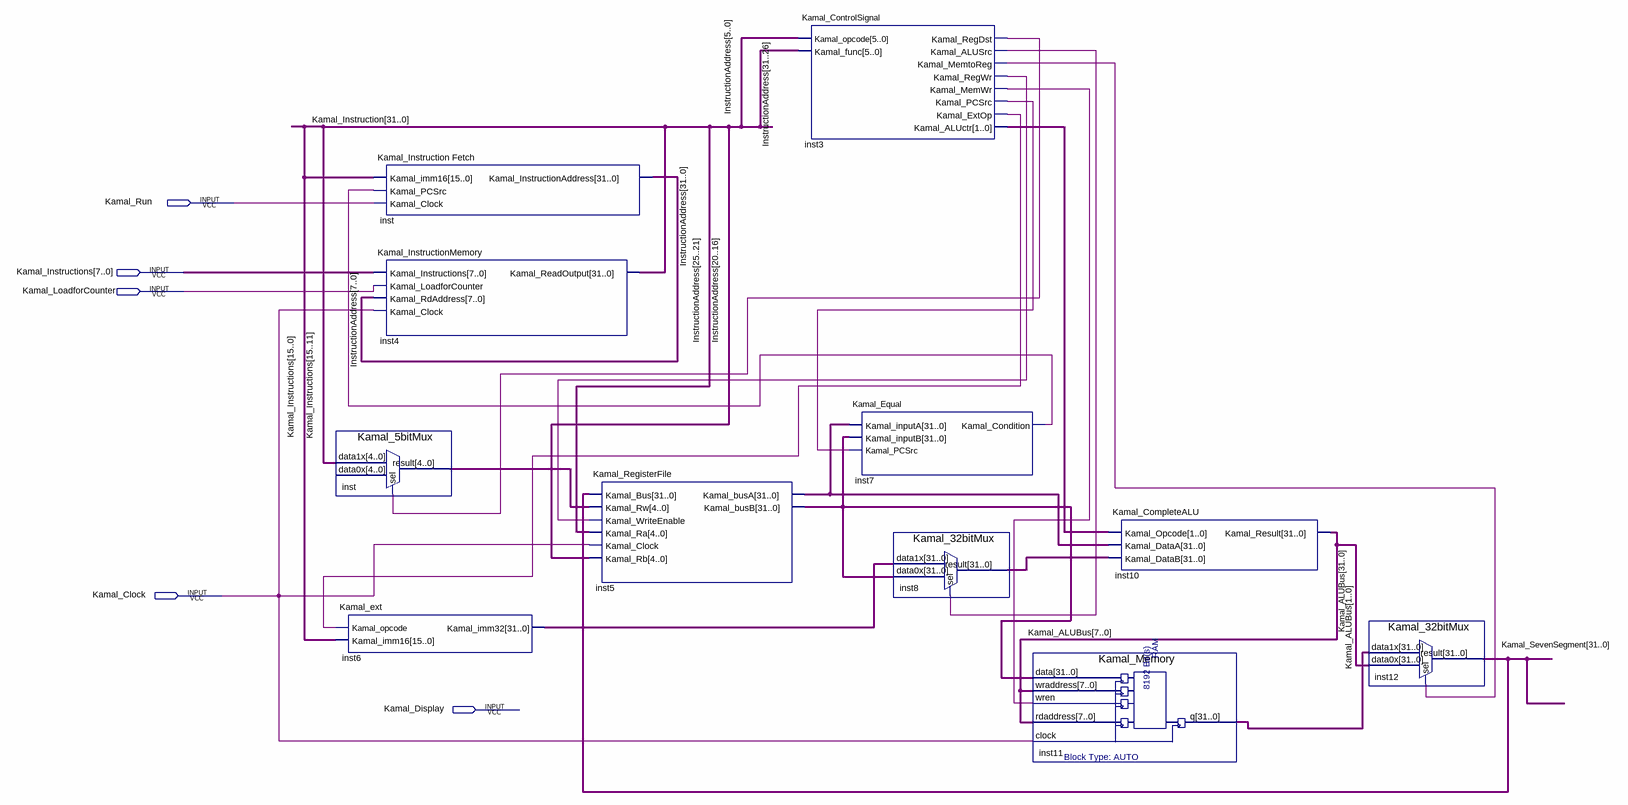
[diagram p0: schematic sheet]
// Quartus schematic Kamal_SevenSegmentDecoder.bdf as structural Verilog: 11 symbols, 5 pins
module Kamal_SevenSegmentDecoder (
  input  Kamal_Run,
  input  [15:0] Kamal_Instructions,
  input  Kamal_LoadforCounter,
  input  Kamal_Clock,
  input  Kamal_Display
);

  wire inst3_kamal_alusrc, inst3_kamal_extop, inst3_kamal_memtoreg, inst3_kamal_memwr, inst3_kamal_pcsrc,
       inst3_kamal_regdst, inst3_kamal_regwr, inst7_kamal_condition;
  wire [1:0] inst3_kamal_aluctr;
  wire [4:0] inst_result;
  wire [31:0] inst5_kamal_busa, inst5_kamal_busb, inst6_kamal_imm32, inst8_result, inst11_q,
       InstructionAddress, Kamal_ALUBus, Kamal_Instruction, Kamal_SevenSegment;

  Kamal_5bitMux inst (
    .data1x(Kamal_Instructions[15:11]), .sel(inst3_kamal_regdst), .result(inst_result));  // open: data0x
  Kamal_ext inst6 (.Kamal_opcode(inst3_kamal_extop), .Kamal_imm16(Kamal_Instructions), .Kamal_imm32(inst6_kamal_imm32));
  \Kamal_Instruction_Fetch  inst_dup2 (
    .Kamal_imm16(Kamal_Instruction), .Kamal_PCSrc(inst7_kamal_condition), .Kamal_Clock(Kamal_Run),
    .Kamal_InstructionAddress(InstructionAddress));
  Kamal_InstructionMemory inst4 (
    .Kamal_Instructions(Kamal_Instructions[7:0]), .Kamal_LoadforCounter(Kamal_LoadforCounter),
    .Kamal_RdAddress(InstructionAddress[7:0]), .Kamal_Clock(Kamal_Clock), .Kamal_ReadOutput(Kamal_Instruction));
  Kamal_RegisterFile inst5 (
    .Kamal_Bus(Kamal_SevenSegment), .Kamal_Rw(inst_result), .Kamal_WriteEnable(inst3_kamal_regwr),
    .Kamal_Ra(InstructionAddress[25:21]), .Kamal_Clock(Kamal_Clock), .Kamal_Rb(InstructionAddress[20:16]),
    .Kamal_busA(inst5_kamal_busa), .Kamal_busB(inst5_kamal_busb));
  Kamal_ControlSignal inst3 (
    .Kamal_opcode(InstructionAddress[5:0]), .Kamal_func(InstructionAddress[31:26]),
    .Kamal_RegDst(inst3_kamal_regdst), .Kamal_ALUSrc(inst3_kamal_alusrc),
    .Kamal_MemtoReg(inst3_kamal_memtoreg), .Kamal_RegWr(inst3_kamal_regwr), .Kamal_MemWr(inst3_kamal_memwr),
    .Kamal_PCSrc(inst3_kamal_pcsrc), .Kamal_ExtOp(inst3_kamal_extop), .Kamal_ALUctr(inst3_kamal_aluctr));
  Kamal_Equal inst7 (
    .Kamal_inputA(inst5_kamal_busa), .Kamal_inputB(inst5_kamal_busb), .Kamal_PCSrc(inst3_kamal_pcsrc),
    .Kamal_Condition(inst7_kamal_condition));
  Kamal_32bitMux inst8 (
    .data1x(inst6_kamal_imm32), .data0x(inst5_kamal_busb), .sel(inst3_kamal_alusrc), .result(inst8_result));
  Kamal_Memory inst11 (
    .data(inst5_kamal_busb), .wraddress(Kamal_ALUBus[7:0]), .wren(inst3_kamal_memwr),
    .rdaddress(Kamal_ALUBus[7:0]), .clock(Kamal_Clock), .q(inst11_q));
  Kamal_CompleteALU inst10 (
    .Kamal_Opcode(inst3_kamal_aluctr), .Kamal_DataA(inst5_kamal_busa), .Kamal_DataB(inst8_result),
    .Kamal_Result(Kamal_ALUBus));
  Kamal_32bitMux inst12 (
    .data1x(inst11_q), .data0x(Kamal_ALUBus[1:0]), .sel(inst3_kamal_memtoreg), .result(Kamal_SevenSegment));
endmodule
